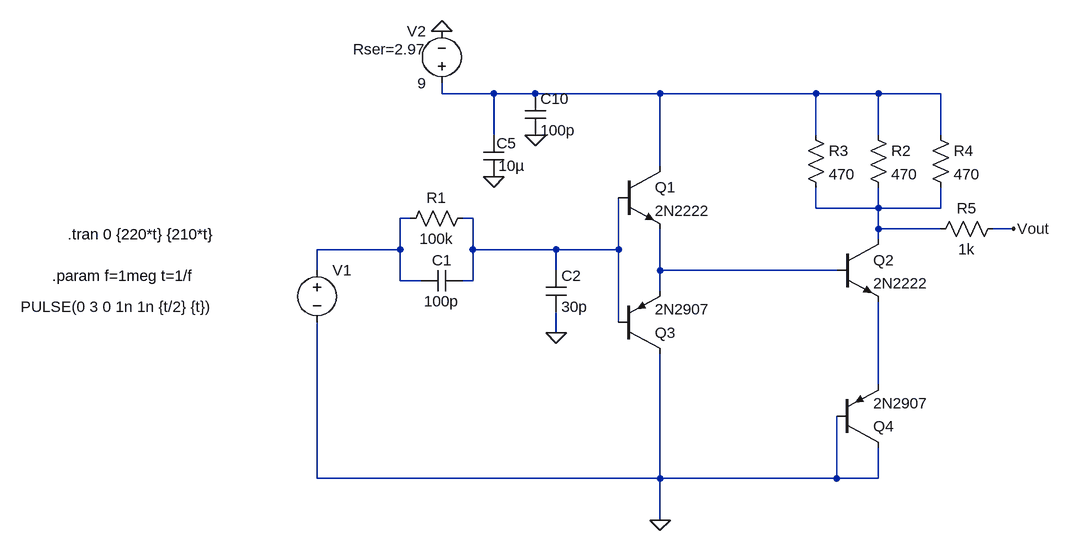
[diagram p0: schematic Square circuit draft.asc]
Square circuit draft.asc, the LTspice schematic file:
Version 4.1
SHEET 1 1256 680
WIRE 208 -96 208 -112
WIRE 288 -96 208 -96
WIRE 352 -96 288 -96
WIRE 544 -96 352 -96
WIRE 784 -96 544 -96
WIRE 880 -96 784 -96
WIRE 976 -96 880 -96
WIRE 288 -32 288 -96
WIRE 784 -32 784 -96
WIRE 880 -32 880 -96
WIRE 976 -32 976 -96
WIRE 544 16 544 -96
WIRE 784 80 784 48
WIRE 880 80 880 48
WIRE 880 80 784 80
WIRE 976 80 976 48
WIRE 976 80 880 80
WIRE 160 96 144 96
WIRE 256 96 240 96
WIRE 880 112 880 80
WIRE 976 112 880 112
WIRE 1088 112 1056 112
WIRE 880 128 880 112
WIRE 144 144 144 96
WIRE 144 144 16 144
WIRE 256 144 256 96
WIRE 384 144 256 144
WIRE 480 144 480 64
WIRE 480 144 384 144
WIRE 16 176 16 144
WIRE 384 176 384 144
WIRE 544 176 544 112
WIRE 816 176 544 176
WIRE 144 192 144 144
WIRE 176 192 144 192
WIRE 256 192 256 144
WIRE 256 192 240 192
WIRE 544 208 544 176
WIRE 480 256 480 144
WIRE 384 272 384 240
WIRE 880 352 880 224
WIRE 16 496 16 256
WIRE 544 496 544 304
WIRE 544 496 16 496
WIRE 816 496 816 400
WIRE 816 496 544 496
WIRE 880 496 880 448
WIRE 880 496 816 496
WIRE 544 560 544 496
FLAG 208 -192 0
FLAG 288 32 0
FLAG 352 -32 0
FLAG 384 272 0
FLAG 1088 112 Vout
FLAG 544 560 0
SYMBOL voltage 16 160 R0
WINDOW 123 0 0 Left 0
WINDOW 39 0 0 Left 0
WINDOW 3 -456 72 Left 2
SYMATTR Value PULSE(0 3 0 1n 1n {t/2} {t})
SYMATTR InstName V1
SYMBOL voltage 208 -96 R180
WINDOW 0 24 96 Left 2
WINDOW 3 24 16 Left 2
WINDOW 123 0 0 Left 0
WINDOW 39 24 68 Left 2
SYMATTR InstName V2
SYMATTR Value 9
SYMATTR SpiceLine Rser=2.97
SYMBOL res 256 80 R90
WINDOW 0 0 56 VBottom 2
WINDOW 3 32 56 VTop 2
SYMATTR InstName R1
SYMATTR Value 100k
SYMBOL cap 304 32 R180
WINDOW 0 -19 52 Left 2
WINDOW 3 -32 17 Left 2
SYMATTR InstName C5
SYMATTR Value 10µ
SYMBOL cap 336 -96 R0
SYMATTR InstName C10
SYMATTR Value 100p
SYMBOL cap 240 176 R90
WINDOW 0 0 32 VBottom 2
WINDOW 3 32 32 VTop 2
SYMATTR InstName C1
SYMATTR Value 100p
SYMBOL npn 480 16 R0
SYMATTR InstName Q1
SYMATTR Value 2N2222
SYMBOL npn 816 128 R0
SYMATTR InstName Q2
SYMATTR Value 2N2222
SYMBOL pnp 480 304 M180
SYMATTR InstName Q3
SYMATTR Value 2N2907
SYMBOL pnp 816 448 M180
SYMATTR InstName Q4
SYMATTR Value 2N2907
SYMBOL cap 368 176 R0
SYMATTR InstName C2
SYMATTR Value 30p
SYMBOL res 864 -48 R0
SYMATTR InstName R2
SYMATTR Value 470
SYMBOL res 768 -48 R0
SYMATTR InstName R3
SYMATTR Value 470
SYMBOL res 960 -48 R0
SYMATTR InstName R4
SYMATTR Value 470
SYMBOL res 1072 96 R90
WINDOW 0 0 56 VBottom 2
WINDOW 3 32 56 VTop 2
SYMATTR InstName R5
SYMATTR Value 1k
TEXT -368 120 Left 2 !.tran 0 {220*t} {210*t}
TEXT -392 184 Left 2 !.param f=1meg t=1/f

The netlist it stands for:
* Square circuit draft.asc
V1 N003 0 PULSE(0 3 0 1n 1n {t/2} {t})
V2 N001 0 9 Rser=2.97
R1 N004 N003 100k
C5 0 N001 10µ
C10 N001 0 100p
C1 N004 N003 100p
Q1 N001 N004 N005 0 2N2222
Q2 N002 N005 N006 0 2N2222
Q3 0 N004 N005 0 2N2907
Q4 0 0 N006 0 2N2907
C2 N004 0 30p
R2 N001 N002 470
R3 N001 N002 470
R4 N001 N002 470
R5 Vout N002 1k
.model NPN NPN
.model PNP PNP
.lib standard.bjt
.tran 0 {220*t} {210*t}
.param f=1meg t=1/f
.backanno
.end